# Altium schematic sheet main.SchDoc
size A4; SheetNumber: 1; SheetTotal: 5
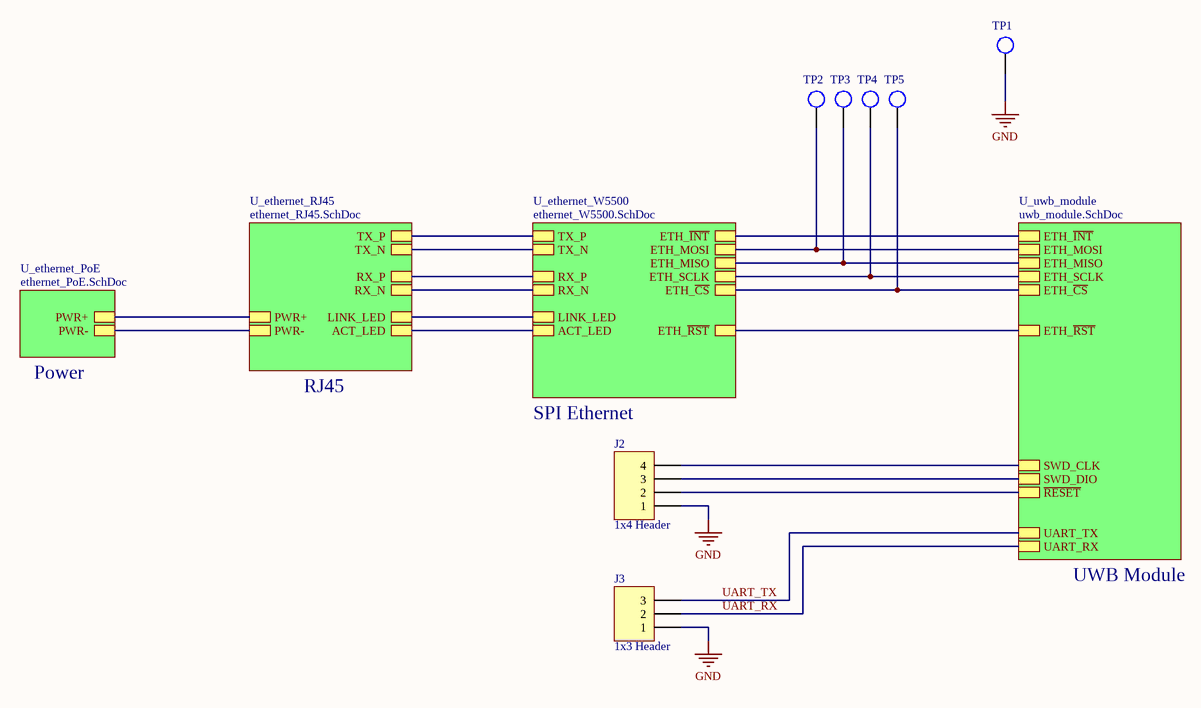
[diagram p0: main.SchDoc]

## Parts
J2  1x4 Header  [HDR1X4]
J3  1x3 Header  [HDR1X3]
TP1  Test Point  [Test Point]  (value not drawn)  (no BOM)
TP2  Test Point  [Test Point]  (value not drawn)  (no BOM)
TP3  Test Point  [Test Point]  (value not drawn)  (no BOM)
TP4  Test Point  [Test Point]  (value not drawn)  (no BOM)
TP5  Test Point  [Test Point]  (value not drawn)  (no BOM)

## Sub-sheets
U_ethernet_PoE = ethernet_PoE.SchDoc: PWR-, PWR+
U_ethernet_RJ45 = ethernet_RJ45.SchDoc: LINK_LED, ACT_LED, TX_P, TX_N, RX_P, RX_N, PWR+, PWR-
U_ethernet_W5500 = ethernet_W5500.SchDoc: ETH_MOSI, ETH_MISO, ETH_SCLK, LINK_LED, ACT_LED, TX_P, TX_N, RX_P, RX_N, ETH_~{INT}, ETH_~{CS}, ETH_~{RST}
U_uwb_module = uwb_module.SchDoc: SWD_CLK, SWD_DIO, ETH_~{CS}, ETH_MOSI, ETH_MISO, ETH_SCLK, ETH_~{INT}, ETH_~{RST}, UART_TX, UART_RX, ~{RESET}

## Nets
GND: J2.1 J3.1 TP1.1
UART_RX: J3.2 ; sheet U_uwb_module/UART_RX
UART_TX: J3.3 ; sheet U_uwb_module/UART_TX
NetJ2_2: J2.2 ; sheet U_uwb_module/~{RESET}
NetJ2_3: J2.3 ; sheet U_uwb_module/SWD_DIO
NetJ2_4: J2.4 ; sheet U_uwb_module/SWD_CLK
NetTP2_1: TP2.1 ; sheet U_ethernet_W5500/ETH_MOSI, sheet U_uwb_module/ETH_MOSI
NetTP3_1: TP3.1 ; sheet U_ethernet_W5500/ETH_MISO, sheet U_uwb_module/ETH_MISO
NetTP4_1: TP4.1 ; sheet U_ethernet_W5500/ETH_SCLK, sheet U_uwb_module/ETH_SCLK
NetTP5_1: TP5.1 ; sheet U_ethernet_W5500/ETH_~{CS}, sheet U_uwb_module/ETH_~{CS}
(unnamed): sheet U_ethernet_PoE/PWR-, sheet U_ethernet_RJ45/PWR-
(unnamed): sheet U_ethernet_PoE/PWR+, sheet U_ethernet_RJ45/PWR+
(unnamed): sheet U_ethernet_RJ45/LINK_LED, sheet U_ethernet_W5500/LINK_LED
(unnamed): sheet U_ethernet_RJ45/ACT_LED, sheet U_ethernet_W5500/ACT_LED
(unnamed): sheet U_ethernet_RJ45/TX_P, sheet U_ethernet_W5500/TX_P
(unnamed): sheet U_ethernet_RJ45/TX_N, sheet U_ethernet_W5500/TX_N
(unnamed): sheet U_ethernet_RJ45/RX_P, sheet U_ethernet_W5500/RX_P
(unnamed): sheet U_ethernet_RJ45/RX_N, sheet U_ethernet_W5500/RX_N
(unnamed): sheet U_ethernet_W5500/ETH_~{INT}, sheet U_uwb_module/ETH_~{INT}
(unnamed): sheet U_ethernet_W5500/ETH_~{RST}, sheet U_uwb_module/ETH_~{RST}

## Notes on the sheet
- Power
- RJ45
- (near J2) SPI Ethernet
- UWB Module

## Library data of the parts
J2 = 1x4 Header: 1x4 Pin Header
J3 = 1x3 Header: 1x3 Pin Header